# EAGLE design Arduino_Mega14x_V2 (EAGLE 9.6.2)
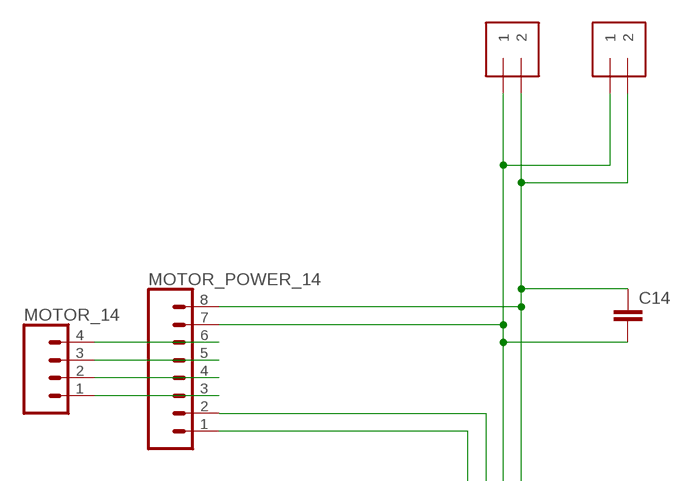
[diagram p0: schematic, sheet 1, part 1 of 3]
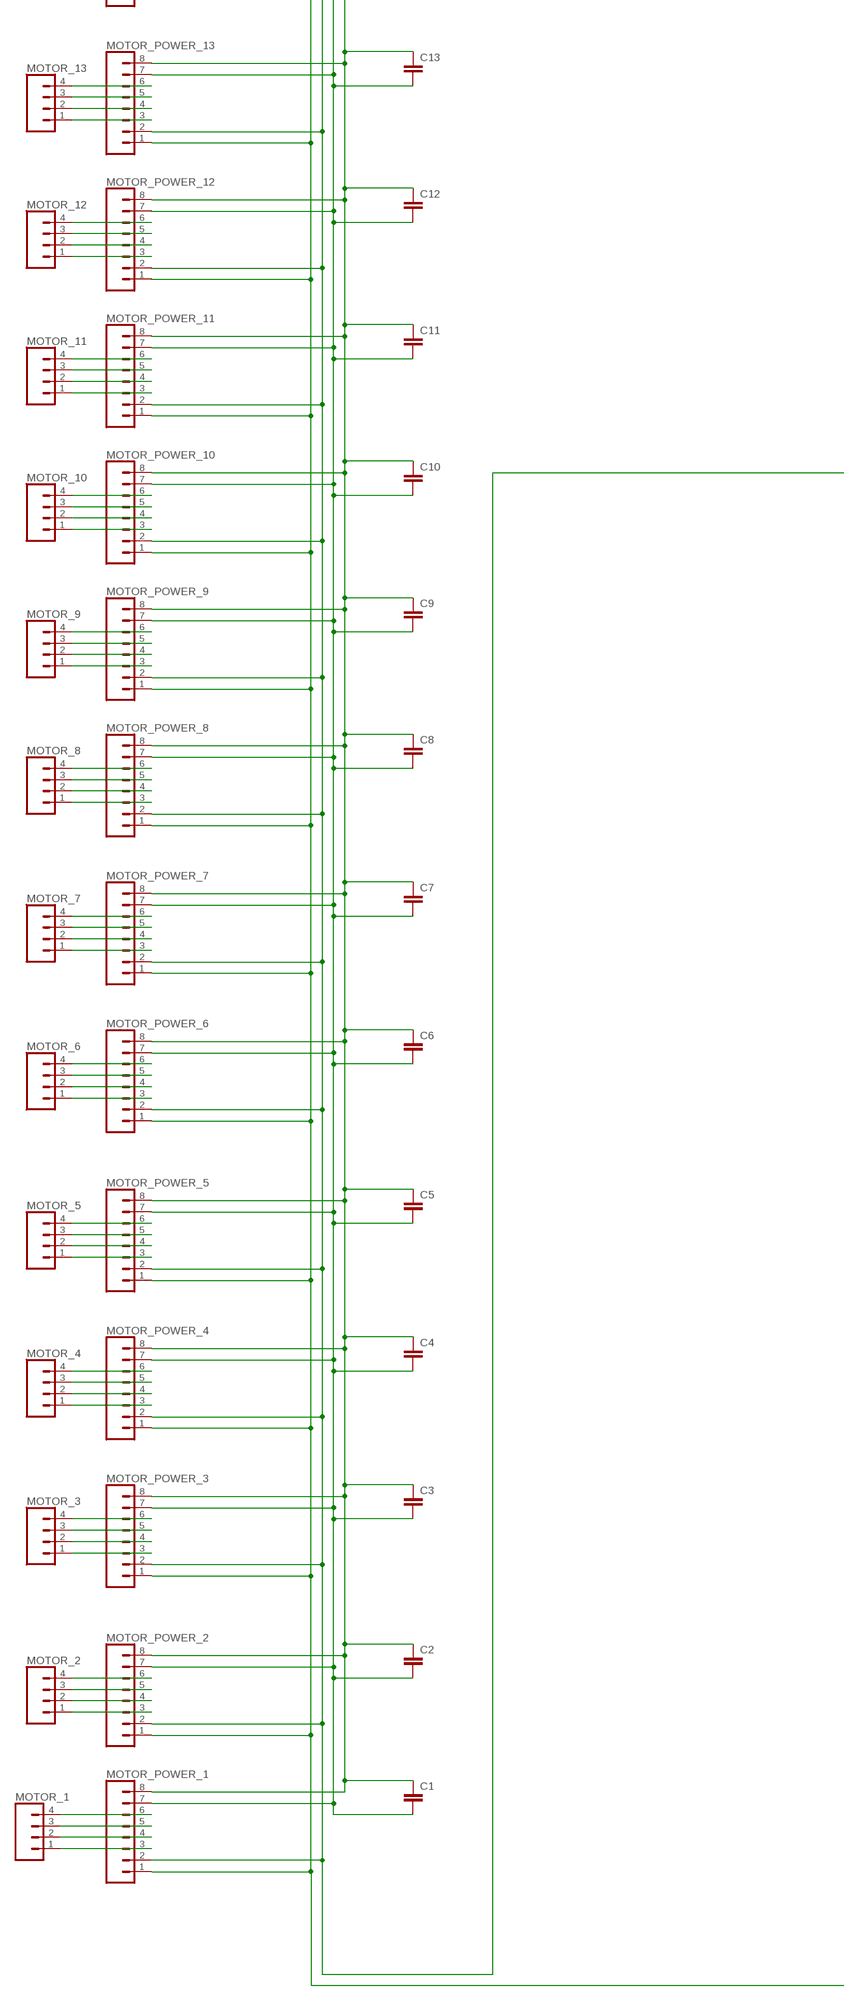
[diagram p1: schematic, sheet 1, part 2 of 3]
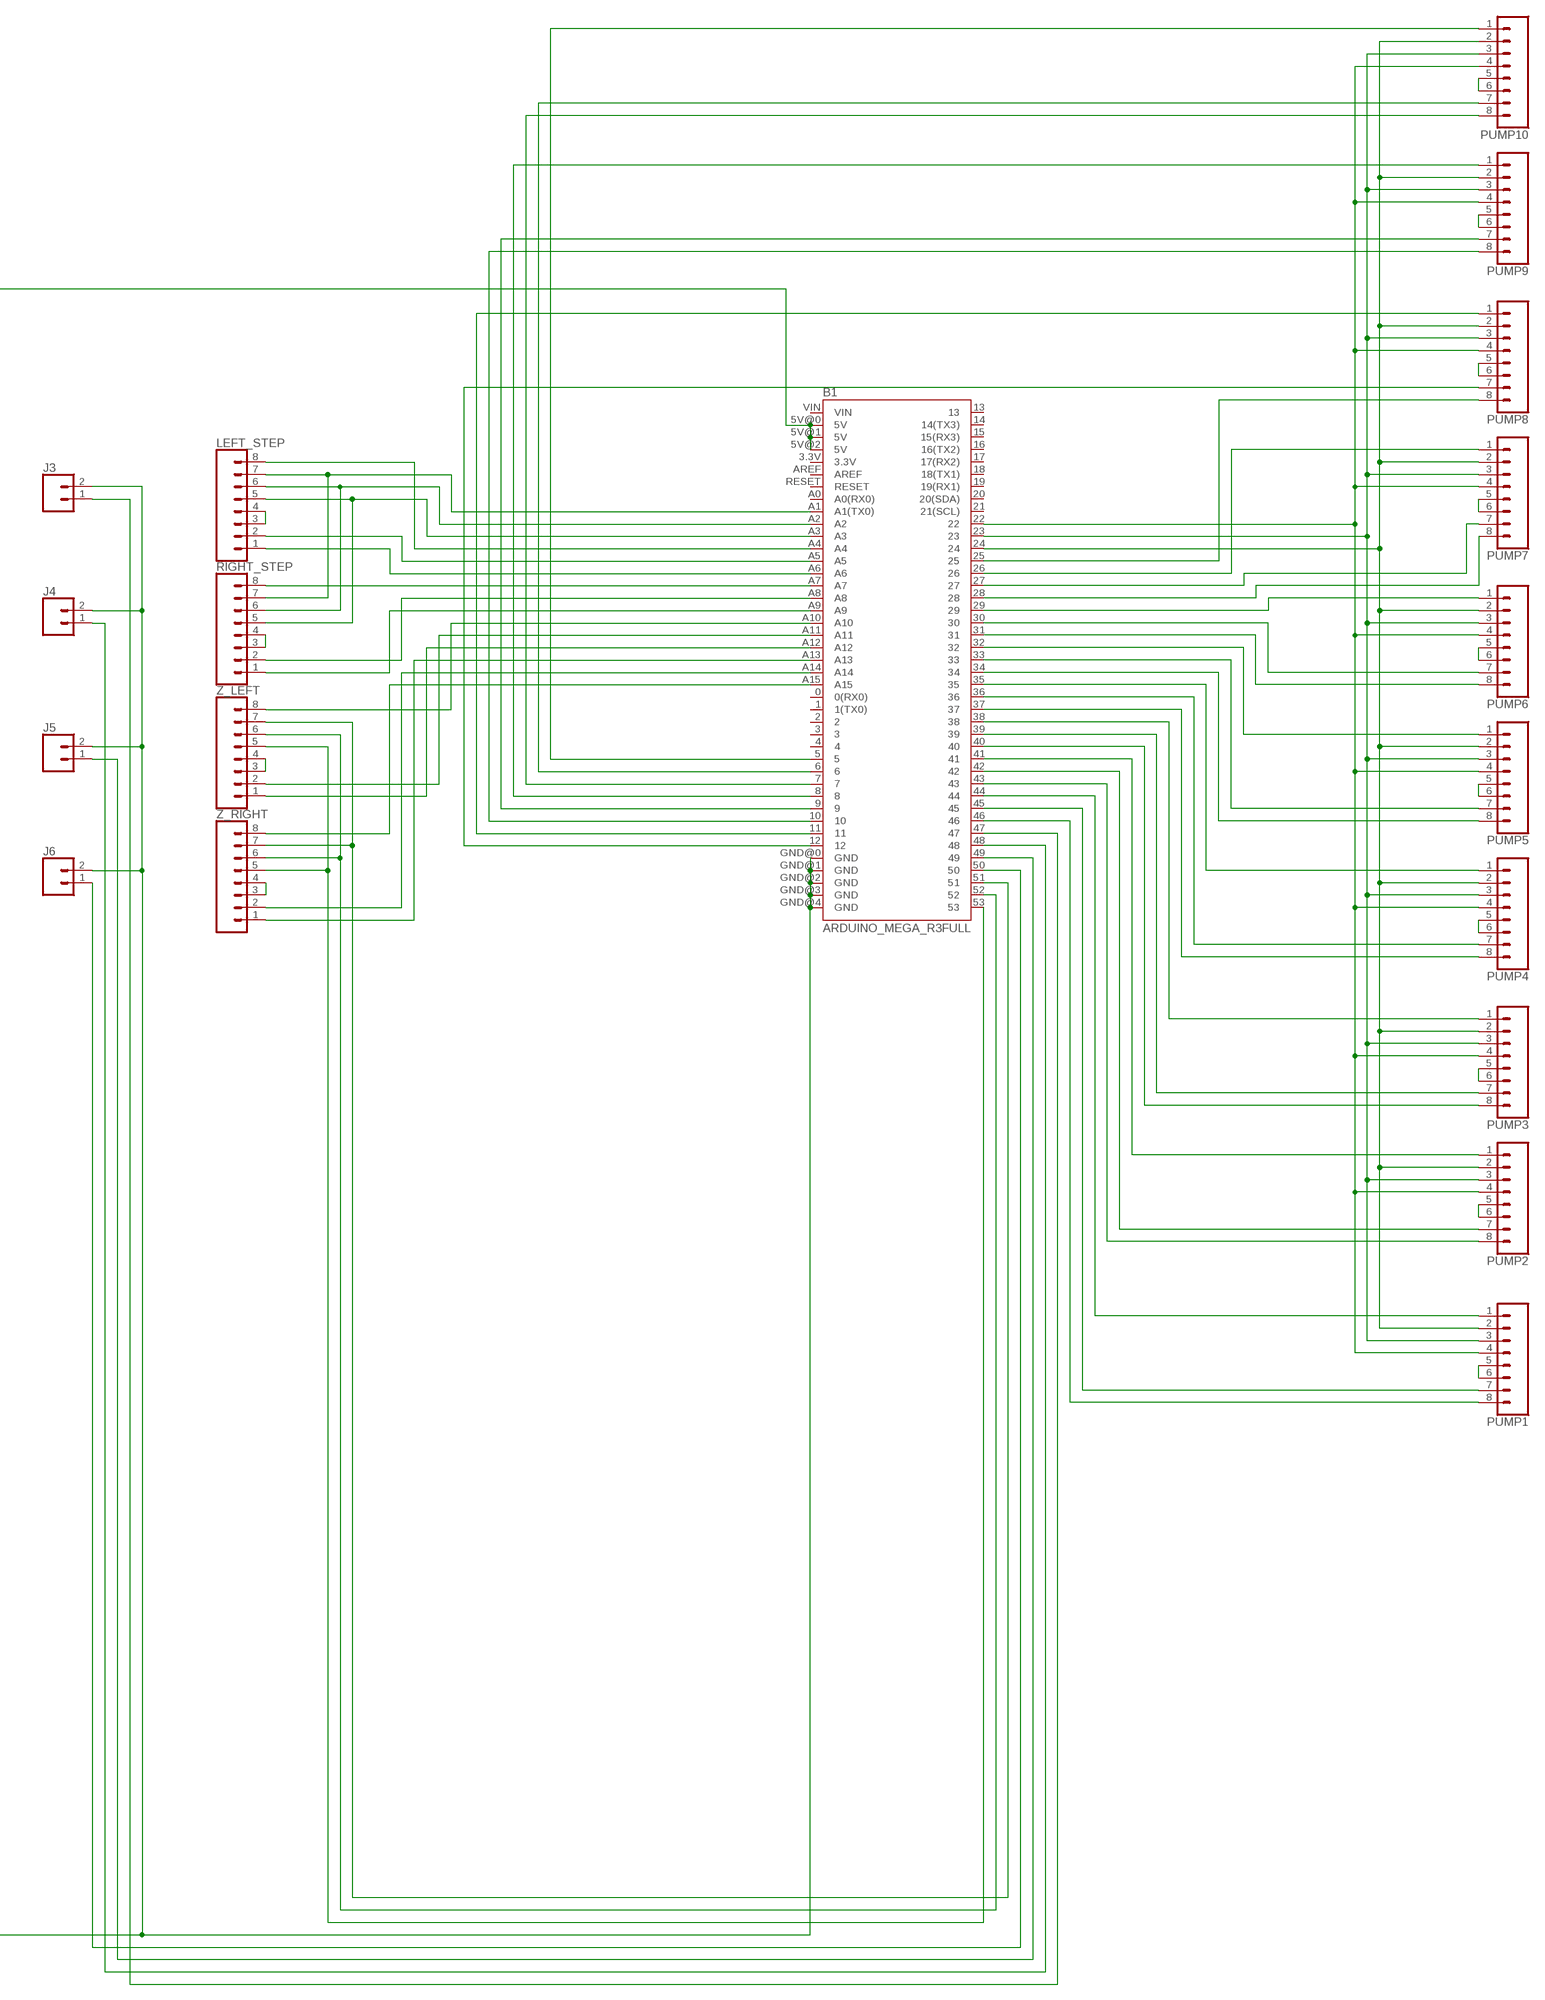
[diagram p2: schematic, sheet 1, part 3 of 3]

## Parts
B1  ARDUINO_MEGA_R3FULL  [ARDUINO_MEGA]
C1  C5/2.5  [C5B2.5]
C2  C5/2.5  [C5B2.5]
C3  C5/2.5  [C5B2.5]
C4  C5/2.5  [C5B2.5]
C5  C5/2.5  [C5B2.5]
C6  C5/2.5  [C5B2.5]
C7  C5/2.5  [C5B2.5]
C8  C5/2.5  [C5B2.5]
C9  C5/2.5  [C5B2.5]
C10  C5/2.5  [C5B2.5]
C11  C5/2.5  [C5B2.5]
C12  C5/2.5  [C5B2.5]
C13  C5/2.5  [C5B2.5]
C14  C5/2.5  [C5B2.5]
J1  1X2-3.5MM  [1X2-3.5MM]
J2  1X2-3.5MM  [1X2-3.5MM]
J3  CONN_02  [1X02]
J4  CONN_02  [1X02]
J5  CONN_02  [1X02]
J6  CONN_02  [1X02]
LEFT_STEP  CONN_08"  [1X08]
MOTOR_1  CONN_04  [1X04]
MOTOR_2  CONN_04  [1X04]
MOTOR_3  CONN_04  [1X04]
MOTOR_4  CONN_04  [1X04]
MOTOR_5  CONN_04  [1X04]
MOTOR_6  CONN_04  [1X04]
MOTOR_7  CONN_04  [1X04]
MOTOR_8  CONN_04  [1X04]
MOTOR_9  CONN_04  [1X04]
MOTOR_10  CONN_04  [1X04]
MOTOR_11  CONN_04  [1X04]
MOTOR_12  CONN_04  [1X04]
MOTOR_13  CONN_04  [1X04]
MOTOR_14  CONN_04  [1X04]
MOTOR_POWER_1  CONN_08"  [1X08]
MOTOR_POWER_2  CONN_08"  [1X08]
MOTOR_POWER_3  CONN_08"  [1X08]
MOTOR_POWER_4  CONN_08"  [1X08]
MOTOR_POWER_5  CONN_08"  [1X08]
MOTOR_POWER_6  CONN_08"  [1X08]
MOTOR_POWER_7  CONN_08"  [1X08]
MOTOR_POWER_8  CONN_08"  [1X08]
MOTOR_POWER_9  CONN_08"  [1X08]
MOTOR_POWER_10  CONN_08"  [1X08]
MOTOR_POWER_11  CONN_08"  [1X08]
MOTOR_POWER_12  CONN_08"  [1X08]
MOTOR_POWER_13  CONN_08"  [1X08]
MOTOR_POWER_14  CONN_08"  [1X08]
PUMP1  CONN_08"  [1X08]
PUMP2  CONN_08"  [1X08]
PUMP3  CONN_08"  [1X08]
PUMP4  CONN_08"  [1X08]
PUMP5  CONN_08"  [1X08]
PUMP6  CONN_08"  [1X08]
PUMP7  CONN_08"  [1X08]
PUMP8  CONN_08"  [1X08]
PUMP9  CONN_08"  [1X08]
PUMP10  CONN_08"  [1X08]
RIGHT_STEP  CONN_08"  [1X08]
Z_LEFT  CONN_08"  [1X08]
Z_RIGHT  CONN_08"  [1X08]

## Nets
N$1: MOTOR_1.1 MOTOR_POWER_1.3
N$2: MOTOR_1.2 MOTOR_POWER_1.4
N$3: MOTOR_1.3 MOTOR_POWER_1.5
N$4: LEFT_STEP.3 LEFT_STEP.4
N$5: MOTOR_1.4 MOTOR_POWER_1.6
N$6: MOTOR_2.1 MOTOR_POWER_2.3
N$7: MOTOR_2.2 MOTOR_POWER_2.4
N$8: RIGHT_STEP.3 RIGHT_STEP.4
N$9: MOTOR_2.3 MOTOR_POWER_2.5
N$10: MOTOR_2.4 MOTOR_POWER_2.6
N$11: MOTOR_3.1 MOTOR_POWER_3.3
N$12: MOTOR_3.2 MOTOR_POWER_3.4
N$13: MOTOR_3.3 MOTOR_POWER_3.5
N$14: MOTOR_3.4 MOTOR_POWER_3.6
N$15: MOTOR_4.1 MOTOR_POWER_4.3
N$16: MOTOR_4.2 MOTOR_POWER_4.4
N$17: MOTOR_4.3 MOTOR_POWER_4.5
N$18: Z_LEFT.3 Z_LEFT.4
N$19: MOTOR_4.4 MOTOR_POWER_4.6
N$20: MOTOR_5.1 MOTOR_POWER_5.3
N$21: MOTOR_5.2 MOTOR_POWER_5.4
N$22: MOTOR_5.3 MOTOR_POWER_5.5
N$23: MOTOR_5.4 MOTOR_POWER_5.6
N$24: MOTOR_6.1 MOTOR_POWER_6.3
N$25: Z_RIGHT.3 Z_RIGHT.4
N$26: MOTOR_6.2 MOTOR_POWER_6.4
N$27: PUMP1.5 PUMP1.6
N$28: MOTOR_6.3 MOTOR_POWER_6.5
N$29: MOTOR_6.4 MOTOR_POWER_6.6
N$30: MOTOR_7.1 MOTOR_POWER_7.3
N$31: MOTOR_7.2 MOTOR_POWER_7.4
N$32: PUMP2.5 PUMP2.6
N$33: MOTOR_7.3 MOTOR_POWER_7.5
N$34: MOTOR_7.4 MOTOR_POWER_7.6
N$35: PUMP3.5 PUMP3.6
N$36: MOTOR_8.1 MOTOR_POWER_8.3
N$37: MOTOR_8.2 MOTOR_POWER_8.4
N$38: MOTOR_8.3 MOTOR_POWER_8.5
N$39: MOTOR_8.4 MOTOR_POWER_8.6
N$40: PUMP4.5 PUMP4.6
N$41: MOTOR_9.1 MOTOR_POWER_9.3
N$42: MOTOR_9.2 MOTOR_POWER_9.4
N$43: MOTOR_9.3 MOTOR_POWER_9.5
N$44: PUMP5.5 PUMP5.6
N$45: MOTOR_9.4 MOTOR_POWER_9.6
N$46: MOTOR_10.1 MOTOR_POWER_10.3
N$47: MOTOR_10.2 MOTOR_POWER_10.4
N$48: PUMP6.5 PUMP6.6
N$49: MOTOR_10.3 MOTOR_POWER_10.5
N$50: MOTOR_10.4 MOTOR_POWER_10.6
N$51: MOTOR_11.1 MOTOR_POWER_11.3
N$52: PUMP7.5 PUMP7.6
N$53: MOTOR_11.2 MOTOR_POWER_11.4
N$54: MOTOR_11.3 MOTOR_POWER_11.5
N$55: MOTOR_11.4 MOTOR_POWER_11.6
N$56: PUMP8.5 PUMP8.6
N$57: MOTOR_12.1 MOTOR_POWER_12.3
N$58: MOTOR_12.2 MOTOR_POWER_12.4
N$59: MOTOR_12.3 MOTOR_POWER_12.5
N$60: PUMP9.5 PUMP9.6
N$61: MOTOR_12.4 MOTOR_POWER_12.6
N$62: MOTOR_13.1 MOTOR_POWER_13.3
N$63: MOTOR_13.2 MOTOR_POWER_13.4
N$64: PUMP10.5 PUMP10.6
N$65: MOTOR_13.3 MOTOR_POWER_13.5
N$66: MOTOR_13.4 MOTOR_POWER_13.6
N$67: MOTOR_14.1 MOTOR_POWER_14.3
N$68: MOTOR_14.2 MOTOR_POWER_14.4
N$69: MOTOR_14.3 MOTOR_POWER_14.5
N$70: MOTOR_14.4 MOTOR_POWER_14.6
N$71: B1.GND@0(GND) B1.GND@1(GND) B1.GND@2(GND) B1.GND@3(GND) B1.GND@4(GND) J3.2 J4.2 J5.2 J6.2 MOTOR_POWER_1.1 MOTOR_POWER_2.1 MOTOR_POWER_3.1 MOTOR_POWER_4.1 MOTOR_POWER_5.1 MOTOR_POWER_6.1 MOTOR_POWER_7.1 MOTOR_POWER_8.1 MOTOR_POWER_9.1 MOTOR_POWER_10.1 MOTOR_POWER_11.1 MOTOR_POWER_12.1 MOTOR_POWER_13.1 MOTOR_POWER_14.1
N$72: B1.A1(A1(TX0)) LEFT_STEP.7 RIGHT_STEP.7
N$73: B1.A2 LEFT_STEP.6 RIGHT_STEP.6
N$74: B1.A3 LEFT_STEP.5 RIGHT_STEP.5
N$75: B1.51 Z_LEFT.7 Z_RIGHT.7
N$76: B1.52 Z_LEFT.6 Z_RIGHT.6
N$77: B1.53 Z_LEFT.5 Z_RIGHT.5
N$78: B1.22 PUMP1.4 PUMP2.4 PUMP3.4 PUMP4.4 PUMP5.4 PUMP6.4 PUMP7.4 PUMP8.4 PUMP9.4 PUMP10.4
N$79: B1.23 PUMP1.3 PUMP2.3 PUMP3.3 PUMP4.3 PUMP5.3 PUMP6.3 PUMP7.3 PUMP8.3 PUMP9.3 PUMP10.3
N$80: B1.24 PUMP1.2 PUMP2.2 PUMP3.2 PUMP4.2 PUMP5.2 PUMP6.2 PUMP7.2 PUMP8.2 PUMP9.2 PUMP10.2
N$81: B1.A15 Z_RIGHT.8
N$82: B1.5V@0(5V) B1.5V@1(5V) B1.5V@2(5V) MOTOR_POWER_1.2 MOTOR_POWER_2.2 MOTOR_POWER_3.2 MOTOR_POWER_4.2 MOTOR_POWER_5.2 MOTOR_POWER_6.2 MOTOR_POWER_7.2 MOTOR_POWER_8.2 MOTOR_POWER_9.2 MOTOR_POWER_10.2 MOTOR_POWER_11.2 MOTOR_POWER_12.2 MOTOR_POWER_13.2 MOTOR_POWER_14.2
N$83 [Thick]: C1.2 C2.2 C3.2 C4.2 C5.2 C6.2 C7.2 C8.2 C9.2 C10.2 C11.2 C12.2 C13.2 C14.2 J1.1 J2.1 MOTOR_POWER_1.7 MOTOR_POWER_2.7 MOTOR_POWER_3.7 MOTOR_POWER_4.7 MOTOR_POWER_5.7 MOTOR_POWER_6.7 MOTOR_POWER_7.7 MOTOR_POWER_8.7 MOTOR_POWER_9.7 MOTOR_POWER_10.7 MOTOR_POWER_11.7 MOTOR_POWER_12.7 MOTOR_POWER_13.7 MOTOR_POWER_14.7
N$84 [Thick]: C1.1 C2.1 C3.1 C4.1 C5.1 C6.1 C7.1 C8.1 C9.1 C10.1 C11.1 C12.1 C13.1 C14.1 J1.2 J2.2 MOTOR_POWER_1.8 MOTOR_POWER_2.8 MOTOR_POWER_3.8 MOTOR_POWER_4.8 MOTOR_POWER_5.8 MOTOR_POWER_6.8 MOTOR_POWER_7.8 MOTOR_POWER_8.8 MOTOR_POWER_9.8 MOTOR_POWER_10.8 MOTOR_POWER_11.8 MOTOR_POWER_12.8 MOTOR_POWER_13.8 MOTOR_POWER_14.8
N$85: B1.A14 Z_RIGHT.2
N$86: B1.A13 Z_RIGHT.1
N$87: B1.A12 Z_LEFT.1
N$88: B1.A11 Z_LEFT.2
N$89: B1.A10 Z_LEFT.8
N$90: B1.A9 RIGHT_STEP.1
N$91: B1.A8 RIGHT_STEP.2
N$92: B1.A7 RIGHT_STEP.8
N$93: B1.A6 LEFT_STEP.1
N$94: B1.A5 LEFT_STEP.2
N$95: B1.A4 LEFT_STEP.8
N$96: B1.50 J6.1
N$97: B1.49 J5.1
N$98: B1.48 J4.1
N$99: B1.47 J3.1
N$100: B1.46 PUMP1.8
N$101: B1.45 PUMP1.7
N$102: B1.44 PUMP1.1
N$103: B1.43 PUMP2.8
N$104: B1.42 PUMP2.7
N$105: B1.41 PUMP2.1
N$106: B1.40 PUMP3.8
N$107: B1.39 PUMP3.7
N$108: B1.38 PUMP3.1
N$109: B1.37 PUMP4.8
N$110: B1.36 PUMP4.7
N$111: B1.35 PUMP4.1
N$112: B1.34 PUMP5.8
N$113: B1.33 PUMP5.7
N$114: B1.32 PUMP5.1
N$115: B1.31 PUMP6.8
N$116: B1.30 PUMP6.7
N$117: B1.29 PUMP6.1
N$118: B1.28 PUMP7.8
N$119: B1.27 PUMP7.7
N$120: B1.26 PUMP7.1
N$121: B1.25 PUMP8.8
N$122: B1.12 PUMP8.7
N$123: B1.11 PUMP8.1
N$124: B1.10 PUMP9.8
N$125: B1.9 PUMP9.7
N$126: B1.8 PUMP9.1
N$127: B1.7 PUMP10.8
N$128: B1.6 PUMP10.7
N$129: B1.5 PUMP10.1
Unconnected: B1.0(0(RX0)) B1.1(1(TX0)) B1.2 B1.3 B1.3.3V B1.4 B1.13 B1.14(14(TX3)) B1.15(15(RX3)) B1.16(16(TX2)) B1.17(17(RX2)) B1.18(18(TX1)) B1.19(19(RX1)) B1.20(20(SDA)) B1.21(21(SCL)) B1.A0(A0(RX0)) B1.AREF B1.RESET B1.VIN

## Library data of the parts
B1 = SparkFun-Mega_Shield:ARDUINO_MEGA_R3: Arduino Mega R3 ATmega2560 R3 compatible footprint. SparkFun Products: Arduino Mega 2560 R3 <https://www.sparkfun.com/products/11061>
C1-C14 = capacitor-wima:C: CAPACITOR naming: grid - package width
J1 J2 = adafruit:1X2: 3.5mm Terminal block http://www.ladyada.net/library/pcb/eaglelibrary.html
J3-J6 = SparkFun-Connectors:CONN_02: Multi connection point. Often used as Generic Header-pin footprint for 0.1 inch spaced/style header connections On any of the 0.1 inch spaced packages, you can populate with these: Break Away Headers - Straight <https://www.sparkfun.com/products/116> (PRT-00116) Break Away Male Headers - Right Angle <https://www.sparkfun.com/products/553> (PRT-00553) Female Headers <https://www.sparkfun.com/products/115> (PRT-00115) Break Away Headers - Machine Pin <https://www.sparkfun.com/products/117> (PRT-00117) Break Away Female Headers - Swiss Machine Pin <https://www.sparkfun.com/products/743> (PRT-00743) For SCREWTERMINALS and SPRING TERMINALS visit here: Screw Terimnals on SparkFun.com <https://www.sparkfun.com/search/results?term=Screw+Terminals> (5mm/3.5mm/2.54mm spacing) This device is also useful as a general connection point to wire up your design to another part of your project. Our various solder wires solder well into these plated through hole pads. Hook-Up Wire - Assortment (Stranded, 22 AWG) <https://www.sparkfun.com/products/11375> (PRT-11375) Hook-Up Wire - Assortment (Solid Core, 22 AWG) <https://www.sparkfun.com/products/11367> (PRT-11367) View the entire wire category on our website here <https://www.sparkfun.com/categories/141> Special notes: Molex polarized connector foot print use with: PRT-08233 with associated crimp pins and housings. 2.54_SCREWTERM for use with PRT-10571. 3.5mm Screw Terminal footprints for PRT-08084 5mm Screw Terminal footprints for use with PRT-08432
LEFT_STEP MOTOR_POWER_1-MOTOR_POWER_14 PUMP1-PUMP10 RIGHT_STEP Z_LEFT Z_RIGHT = SparkFun-Connectors:CONN_08: Multi connection point. Often used as Generic Header-pin footprint for 0.1 inch spaced/style header connections On any of the 0.1 inch spaced packages, you can populate with these: Break Away Headers - Straight <https://www.sparkfun.com/products/116> (PRT-00116) Break Away Male Headers - Right Angle <https://www.sparkfun.com/products/553> (PRT-00553) Female Headers <https://www.sparkfun.com/products/115> (PRT-00115) Break Away Headers - Machine Pin <https://www.sparkfun.com/products/117> (PRT-00117) Break Away Female Headers - Swiss Machine Pin <https://www.sparkfun.com/products/743> (PRT-00743) Arduino Stackable Header - 8 Pin <https://www.sparkfun.com/products/9279> (PRT-09279) For SCREWTERMINALS and SPRING TERMINALS visit here: Screw Terimnals on SparkFun.com <https://www.sparkfun.com/search/results?term=Screw+Terminals> (5mm/3.5mm/2.54mm spacing) This device is also useful as a general connection point to wire up your design to another part of your project. Our various solder wires solder well into these plated through hole pads. Hook-Up Wire - Assortment (Stranded, 22 AWG) <https://www.sparkfun.com/products/11375> (PRT-11375) Hook-Up Wire - Assortment (Solid Core, 22 AWG) <https://www.sparkfun.com/products/11367> (PRT-11367) View the entire wire category on our website here <https://www.sparkfun.com/categories/141> Special notes: Molex polarized connector foot print use with SKU : PRT-08231 with associated crimp pins and housings. 1MM SMD Version SKU: PRT-10208 NOTES ON THE VARIANTS LOCK and LOCK_LONGPADS... This footprint was designed to help hold the alignment of a through-hole component (i.e. 6-pin header) while soldering it into place. You may notice that each hole has been shifted either up or down by 0.005 of an inch from it's more standard position (which is a perfectly straight line). This slight alteration caused the pins (the squares in the middle) to touch the edges of the holes. Because they are alternating, it causes a "brace" to hold the component in place. 0.005 has proven to be the perfect amount of "off-center" position when using our standard breakaway headers. Although looks a little odd when you look at the bare footprint, once you have a header in there, the alteration is very hard to notice. Also,if you push a header all the way into place, it is covered up entirely on the bottom side.; PROD_ID: CONN-08438
MOTOR_1-MOTOR_14 = SparkFun-Connectors:CONN_04: Multi connection point. Often used as Generic Header-pin footprint for 0.1 inch spaced/style header connections On any of the 0.1 inch spaced packages, you can populate with these: Break Away Headers - Straight <https://www.sparkfun.com/products/116> (PRT-00116) Break Away Male Headers - Right Angle <https://www.sparkfun.com/products/553> (PRT-00553) Female Headers <https://www.sparkfun.com/products/115> (PRT-00115) Break Away Headers - Machine Pin <https://www.sparkfun.com/products/117> (PRT-00117) Break Away Female Headers - Swiss Machine Pin <https://www.sparkfun.com/products/743> (PRT-00743) For SCREWTERMINALS and SPRING TERMINALS visit here: Screw Terimnals on SparkFun.com <https://www.sparkfun.com/search/results?term=Screw+Terminals> (5mm/3.5mm/2.54mm spacing) This device is also useful as a general connection point to wire up your design to another part of your project. Our various solder wires solder well into these plated through hole pads. Hook-Up Wire - Assortment (Stranded, 22 AWG) <https://www.sparkfun.com/products/11375> (PRT-11375) Hook-Up Wire - Assortment (Solid Core, 22 AWG) <https://www.sparkfun.com/products/11367> (PRT-11367) View the entire wire category on our website here <https://www.sparkfun.com/categories/141> Special notes: Molex polarized connector foot print use with SKU : PRT-08231 with associated crimp pins and housings. 1MM SMD Version SKU: PRT-10208; PROD_ID: CONN-09696

## Net classes
1 Thick: width 0.5 mm, clearance 0.5 mm

## Board
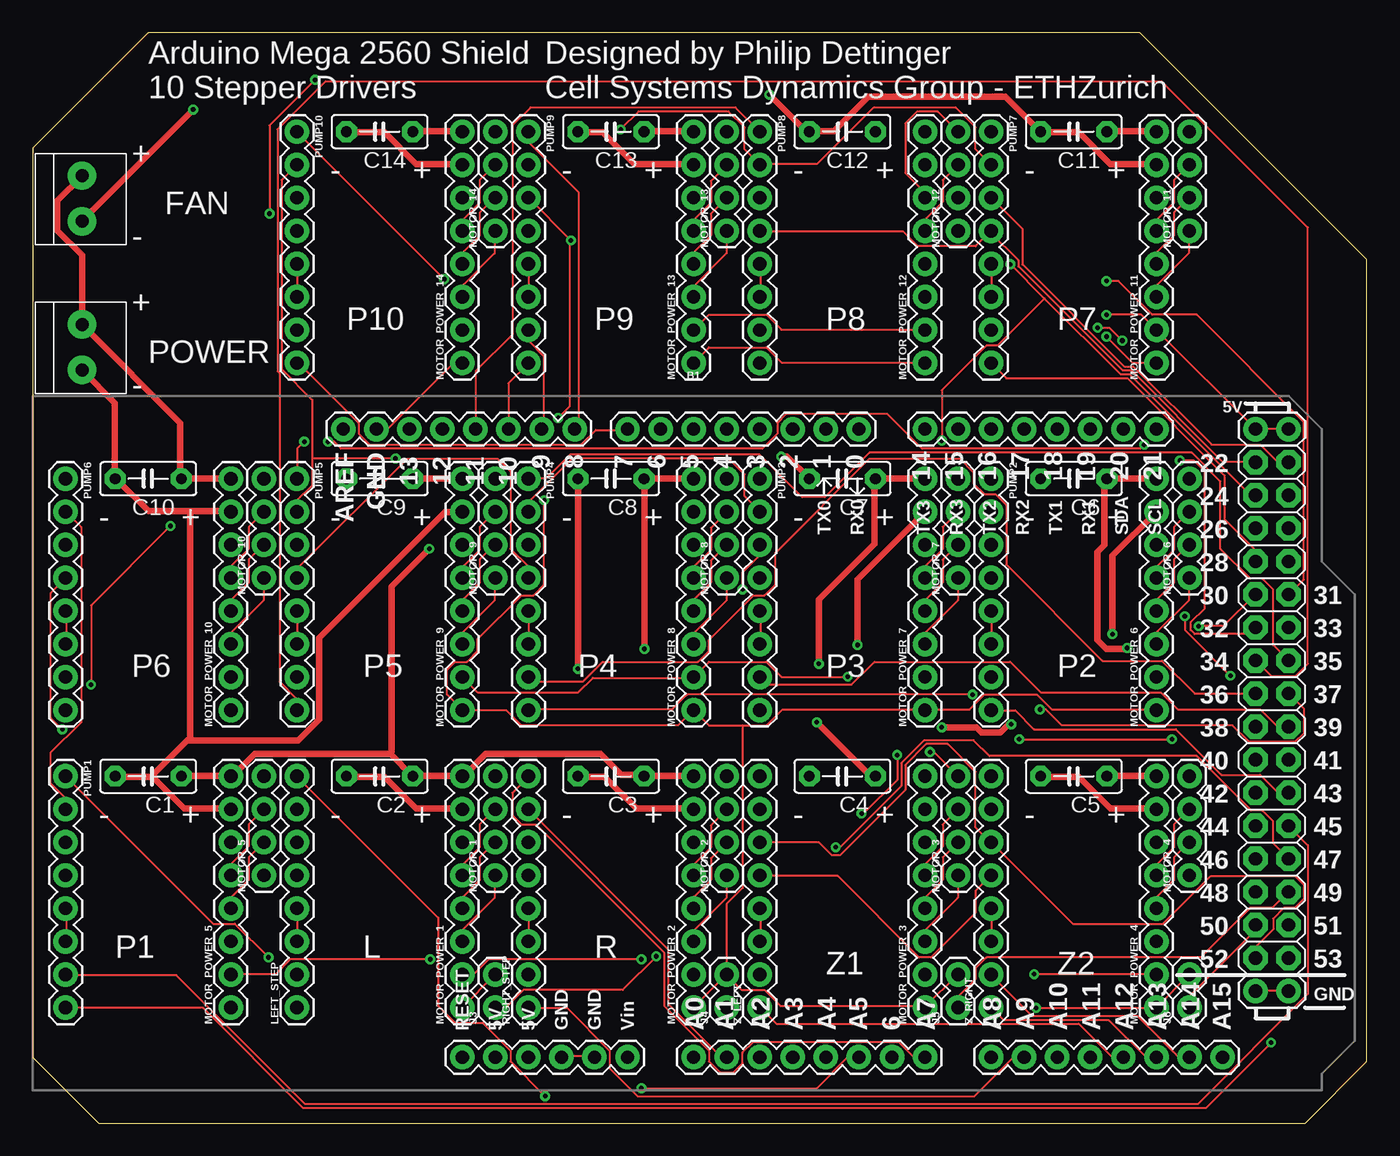
[diagram p3: board, top side]
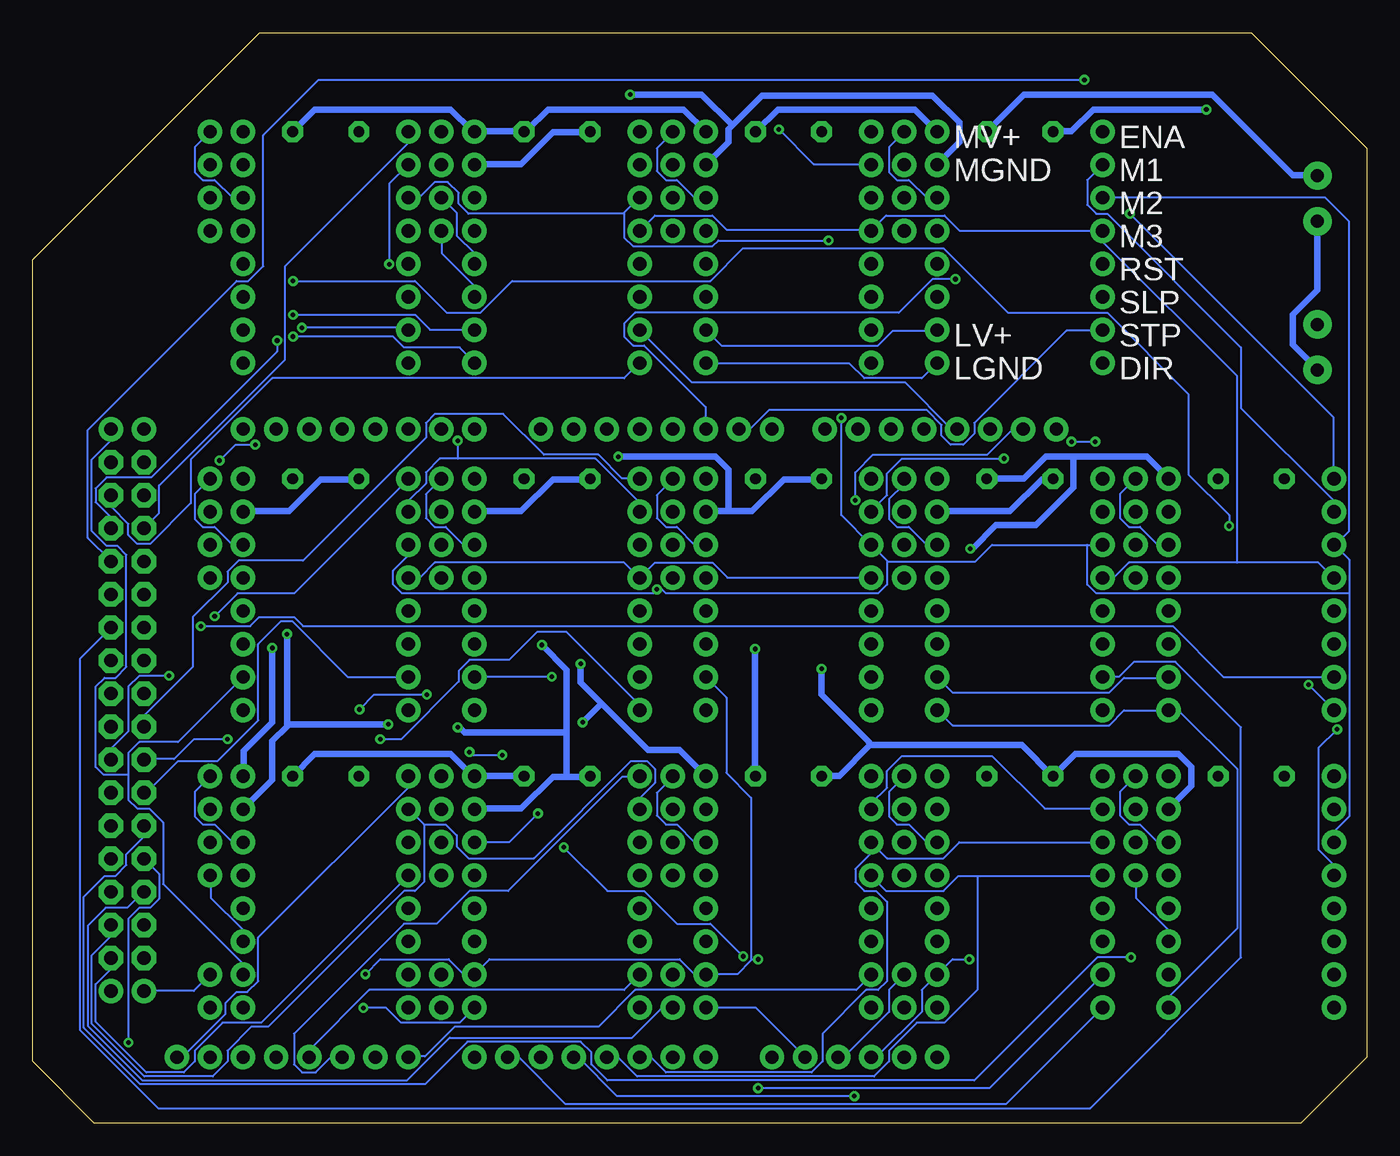
[diagram p4: board, bottom side, seen from below]

Size 102.54 x 83.82 mm. Coordinates in mm from the lower left corner, seen from the top.
Outline: 0,74.93 0,5.08 5.08,0 97.79,0 102.54,4.75 102.54,66.37 85.09,83.82 8.89,83.82 0,74.93
Copper layers (1*16): Top 0.035mm / dielectric 1.5mm / Bottom 0.035mm
Design rules "default": minimum track width 6mil, minimum drill 0.35mm, track to track 6mil, track to pad 6mil, pad to pad 6mil, via to via 6mil, smd to smd 6mil, copper to edge 40mil, drill to drill 6mil, minimum pad ring 10mil, minimum via ring 8mil, stop-mask expansion 4mil, vias tented up to drill 0mil, thermal gap 10mil

### Footprints (pad centres in the part's own frame; a part is rotated, then mirrored left to right if it is on the bottom)
ARDUINO_MEGA = drill 1.016 pad 1.88: 0 13.97,24.13; 1 11.43,24.13; 2 8.89,24.13; 3 6.35,24.13; 3.3V -13.97,-24.13; 4 3.81,24.13; 5 1.27,24.13; 5V@0 -11.43,-24.13; 5V@1 44.45,24.13; 5V@2 46.99,24.13; 6 -1.27,24.13; 7 -3.81,24.13; 8 -7.874,24.13; 9 -10.414,24.13; 10 -12.954,24.13; 11 -15.494,24.13; 12 -18.034,24.13; 13 -20.574,24.13; 14 19.05,24.13; 15 21.59,24.13; 16 24.13,24.13; 17 26.67,24.13; 18 29.21,24.13; 19 31.75,24.13; 20 34.29,24.13; 21 36.83,24.13; A0 1.27,-24.13; A1 3.81,-24.13; A2 6.35,-24.13; A3 8.89,-24.13; A4 11.43,-24.13; A5 13.97,-24.13; A6 16.51,-24.13; A7 19.05,-24.13; A8 24.13,-24.13; A9 26.67,-24.13; A10 29.21,-24.13; A11 31.75,-24.13; A12 34.29,-24.13; A13 36.83,-24.13; A14 39.37,-24.13; A15 41.91,-24.13; AREF -25.654,24.13; GND@0 -8.89,-24.13; GND@1 -6.35,-24.13; GND@2 44.45,-19.05; GND@3 46.99,-19.05; GND@4 -23.114,24.13; RESET -16.51,-24.13; VIN -3.81,-24.13 | drill 1.016 pad 1.88 octagon: 22 44.45,21.59; 23 46.99,21.59; 24 44.45,19.05; 25 46.99,19.05; 26 44.45,16.51; 27 46.99,16.51; 28 44.45,13.97; 29 46.99,13.97; 30 44.45,11.43; 31 46.99,11.43; 32 44.45,8.89; 33 46.99,8.89; 34 44.45,6.35; 35 46.99,6.35; 36 44.45,3.81; 37 46.99,3.81; 38 44.45,1.27; 39 46.99,1.27; 40 44.45,-1.27; 41 46.99,-1.27; 42 44.45,-3.81; 43 46.99,-3.81; 44 44.45,-6.35; 45 46.99,-6.35; 46 44.45,-8.89; 47 46.99,-8.89; 48 44.45,-11.43; 49 46.99,-11.43; 50 44.45,-13.97; 51 46.99,-13.97; 52 44.45,-16.51; 53 46.99,-16.51
C5B2.5 = drill 0.813 pad 1.6 octagon: 1 -2.54,0; 2 2.54,0
1X2-3.5MM = drill 1 pad 2.184: 1 1.8,0; 2 -1.7,0
1X02 = drill 1.016 pad 1.88: 1 0,0; 2 2.54,0
1X08 = drill 1.016 pad 1.88: 1 0,0; 2 2.54,0; 3 5.08,0; 4 7.62,0; 5 10.16,0; 6 12.7,0; 7 15.24,0; 8 17.78,0
1X04 = drill 1.016 pad 1.88: 1 0,0; 2 2.54,0; 3 5.08,0; 4 7.62,0

### Placement (x,y rotation side)
B1  49.53,29.21 0 top
C1  8.89,26.67 180 top
C2  26.67,26.67 180 top
C3  44.45,26.67 180 top
C4  62.23,26.67 180 top
C5  80.01,26.67 180 top
C6  80.01,49.53 180 top
C7  62.23,49.53 180 top
C8  44.45,49.53 180 top
C9  26.67,49.53 180 top
C10  8.89,49.53 180 top
C11  80.01,76.2 180 top
C12  62.23,76.2 180 top
C13  44.45,76.2 180 top
C14  26.67,76.2 180 top
J1  3.81,71.12 270 top
J2  3.81,59.69 270 top
J3  35.56,8.89 90 top
J4  53.34,8.89 90 top
J5  71.12,8.89 90 top
J6  88.9,8.89 90 top
LEFT_STEP  20.32,8.89 90 top
MOTOR_1  35.56,19.05 90 top
MOTOR_2  53.34,19.05 90 top
MOTOR_3  71.12,19.05 90 top
MOTOR_4  88.9,19.05 90 top
MOTOR_5  17.78,19.05 90 top
MOTOR_6  88.9,41.91 90 top
MOTOR_7  71.12,41.91 90 top
MOTOR_8  53.34,41.91 90 top
MOTOR_9  35.56,41.91 90 top
MOTOR_10  17.78,41.91 90 top
MOTOR_11  88.9,68.58 90 top
MOTOR_12  71.12,68.58 90 top
MOTOR_13  53.34,68.58 90 top
MOTOR_14  35.56,68.58 90 top
MOTOR_POWER_1  33.02,8.89 90 top
MOTOR_POWER_2  50.8,8.89 90 top
MOTOR_POWER_3  68.58,8.89 90 top
MOTOR_POWER_4  86.36,8.89 90 top
MOTOR_POWER_5  15.24,8.89 90 top
MOTOR_POWER_6  86.36,31.75 90 top
MOTOR_POWER_7  68.58,31.75 90 top
MOTOR_POWER_8  50.8,31.75 90 top
MOTOR_POWER_9  33.02,31.75 90 top
MOTOR_POWER_10  15.24,31.75 90 top
MOTOR_POWER_11  86.36,58.42 90 top
MOTOR_POWER_12  68.58,58.42 90 top
MOTOR_POWER_13  50.8,58.42 90 top
MOTOR_POWER_14  33.02,58.42 90 top
PUMP1  2.54,26.67 270 top
PUMP2  73.66,49.53 270 top
PUMP3  55.88,49.53 270 top
PUMP4  38.1,49.53 270 top
PUMP5  20.32,49.53 270 top
PUMP6  2.54,49.53 270 top
PUMP7  73.66,76.2 270 top
PUMP8  55.88,76.2 270 top
PUMP9  38.1,76.2 270 top
PUMP10  20.32,76.2 270 top
RIGHT_STEP  38.1,8.89 90 top
Z_LEFT  55.88,8.89 90 top
Z_RIGHT  73.66,8.89 90 top

### Tracks (layer width: path | path; a pad name or v marks a point on that pad's centre or on a via)
N$1
  Top 0.152: MOTOR_POWER_1.3 33.07,13.97 33.07,14.88 35.51,17.32 35.51,19 MOTOR_1.1
N$2
  Top 0.152: MOTOR_POWER_1.4 33.07,16.56 33.07,17.4 34.37,18.69 34.37,20.45 35.51,21.59 MOTOR_1.2
N$3
  Top 0.152: MOTOR_POWER_1.5 33.07,19.07 33.07,19.91 34.37,21.21 34.37,22.96 35.51,24.11 MOTOR_1.3
N$4
  Top 0.152: LEFT_STEP.3 20.34,13.97 20.34,16.48 LEFT_STEP.4
N$5
  Bottom 0.152: MOTOR_POWER_1.6 33.83,21.59 35.2,22.96 36.12,22.96 36.73,23.57 36.73,25.48 35.59,26.62 MOTOR_1.4
N$6
  Top 0.152: MOTOR_2.1 53.34,17.32 50.83,14.81 50.83,13.97 MOTOR_POWER_2.3
N$7
  Top 0.152: MOTOR_2.2 52.12,20.37 52.12,18.69 50.83,17.4 50.83,16.56 MOTOR_POWER_2.4
N$8
  Top 0.152: RIGHT_STEP.4 RIGHT_STEP.3
N$9
  Top 0.152: MOTOR_POWER_2.5 50.83,19.07 50.83,19.91 52.12,21.21 52.12,22.88 53.34,24.11 MOTOR_2.3
N$10
  Bottom 0.152: MOTOR_POWER_2.6 51.66,21.59 53.03,22.96 53.87,22.96 54.56,23.65 54.56,25.4 53.34,26.62 MOTOR_2.4
N$11
  Top 0.152: MOTOR_POWER_3.3 68.58,14.81 71.09,17.32 71.09,19 MOTOR_3.1
N$12
  Top 0.152: MOTOR_POWER_3.4 68.58,17.32 69.95,18.69 69.95,20.45 71.09,21.59 MOTOR_3.2
N$13
  Top 0.152: MOTOR_POWER_3.5 68.58,19.91 69.95,21.29 69.95,22.96 MOTOR_3.3
N$14  (via drill 0.35)
  Top 0.152: v63.7,23.8 63.86,23.8 66.45,26.39 v66.45,28.3 | v68.96,28.52 69.27,28.52 MOTOR_3.4
  Bottom 0.152: MOTOR_POWER_3.6 65.91,21.59 v63.7,23.8 | v66.45,28.3 68.73,28.3 v68.96,28.52
N$15
  Bottom 0.152: MOTOR_POWER_4.3 86.41,13.97 86.41,14.88 88.85,17.32 88.85,19 MOTOR_4.1
N$16
  Top 0.152: MOTOR_POWER_4.4 86.41,16.56 86.41,17.4 87.71,18.69 87.71,20.45 88.85,21.59 MOTOR_4.2
N$17
  Top 0.152: MOTOR_POWER_4.5 86.41,19.07 86.41,19.91 87.71,21.21 87.71,22.96 88.85,24.11 MOTOR_4.3
N$18
  Top 0.152: Z_LEFT.3 55.93,13.97 55.93,16.48 Z_LEFT.4
N$19
  Bottom 0.152: MOTOR_POWER_4.6 87.17,21.59 88.54,22.96 89.46,22.96 90.07,23.57 90.07,25.48 88.92,26.62 MOTOR_4.4
N$20
  Bottom 0.152: MOTOR_POWER_5.3 15.24,14.81 17.75,17.32 17.75,19 MOTOR_5.1
N$21
  Top 0.152: MOTOR_POWER_5.4 15.24,17.32 16.61,18.69 16.61,20.45 17.75,21.59 MOTOR_5.2
N$22
  Top 0.152: MOTOR_POWER_5.5 15.24,19.91 16.61,21.29 16.61,22.96 MOTOR_5.3
N$23
  Bottom 0.152: MOTOR_POWER_5.6 16.08,21.59 17.45,22.96 18.29,22.96 18.97,23.65 18.97,25.48 MOTOR_5.4
N$24
  Top 0.152: MOTOR_POWER_6.3 86.41,36.83 86.41,37.74 88.85,40.18 88.85,41.86 MOTOR_6.1
N$25
  Top 0.152: Z_RIGHT.3 73.69,13.97 73.69,16.48 Z_RIGHT.4
N$26
  Top 0.152: MOTOR_POWER_6.4 86.41,39.42 86.41,40.26 87.71,41.55 87.71,43.31 88.85,44.45 MOTOR_6.2
N$27
  Top 0.152: PUMP1.6 2.59,13.97 2.59,16.48 PUMP1.5
N$28
  Top 0.152: MOTOR_POWER_6.5 86.41,41.94 86.41,42.77 87.71,44.07 87.71,45.82 88.85,46.96 MOTOR_6.3
N$29
  Bottom 0.152: MOTOR_POWER_6.6 87.17,44.45 88.54,45.82 89.46,45.82 90.07,46.43 90.07,48.34 88.92,49.48 MOTOR_6.4
N$30
  Top 0.152: MOTOR_POWER_7.3 68.58,37.67 71.09,40.18 71.09,41.86 MOTOR_7.1
N$31
  Top 0.152: MOTOR_POWER_7.4 68.58,40.18 69.95,41.55 69.95,43.31 71.09,44.45 MOTOR_7.2
N$32
  Top 0.152: PUMP2.6 73.69,36.83 73.69,39.34 PUMP2.5
N$33
  Top 0.152: MOTOR_POWER_7.5 68.58,42.77 69.95,44.14 69.95,45.82 MOTOR_7.3
N$34
  Bottom 0.152: MOTOR_POWER_7.6 69.42,44.45 70.79,45.82 71.63,45.82 72.31,46.51 72.31,48.34 MOTOR_7.4
N$35
  Top 0.152: PUMP3.6 55.93,36.83 55.93,39.34 PUMP3.5
N$36
  Top 0.152: MOTOR_8.1 53.34,40.18 50.83,37.67 50.83,36.83 MOTOR_POWER_8.3
N$37
  Top 0.152: MOTOR_8.2 52.12,43.23 52.12,41.55 50.83,40.26 50.83,39.42 MOTOR_POWER_8.4
N$38
  Top 0.152: MOTOR_POWER_8.5 50.83,41.94 50.83,42.77 52.12,44.07 52.12,45.74 53.34,46.96 MOTOR_8.3
N$39
  Bottom 0.152: MOTOR_POWER_8.6 51.66,44.45 53.03,45.82 53.87,45.82 54.56,46.51 54.56,48.26 53.34,49.48 MOTOR_8.4
N$40
  Top 0.152: PUMP4.5 PUMP4.6
N$41
  Top 0.152: MOTOR_POWER_9.3 33.07,36.83 33.07,37.74 35.51,40.18 35.51,41.86 MOTOR_9.1
N$42
  Top 0.152: MOTOR_POWER_9.4 33.07,39.42 33.07,40.26 34.37,41.55 34.37,43.31 35.51,44.45 MOTOR_9.2
N$43
  Top 0.152: MOTOR_POWER_9.5 33.07,41.94 33.07,42.77 34.37,44.07 34.37,45.82 35.51,46.96 MOTOR_9.3
N$44
  Top 0.152: PUMP5.6 20.34,36.83 20.34,39.34 PUMP5.5
N$45
  Bottom 0.152: MOTOR_POWER_9.6 33.83,44.45 35.2,45.82 36.12,45.82 36.73,46.43 36.73,47.95 35.59,49.1 35.59,49.48 MOTOR_9.4
N$46
  Top 0.152: MOTOR_POWER_10.3 15.24,37.67 17.75,40.18 17.75,41.86 MOTOR_10.1
N$47
  Top 0.152: MOTOR_POWER_10.4 15.24,40.18 16.61,41.55 16.61,43.31 17.75,44.45 MOTOR_10.2
N$48
  Top 0.152: PUMP6.6 2.59,36.83 2.59,39.34 PUMP6.5
N$49
  Top 0.152: MOTOR_POWER_10.5 15.24,42.77 16.61,44.14 16.61,45.82 MOTOR_10.3
N$50
  Bottom 0.152: MOTOR_POWER_10.6 16.08,44.45 17.45,45.82 18.29,45.82 18.97,46.51 18.97,48.34 MOTOR_10.4
N$51
  Top 0.152: MOTOR_POWER_11.3 86.41,63.5 86.41,64.41 88.85,66.85 88.85,68.53 MOTOR_11.1
N$52
  Top 0.152: PUMP7.6 73.69,63.5 73.69,66.02 PUMP7.5
N$53
  Top 0.152: MOTOR_POWER_11.4 86.41,66.09 86.41,66.93 87.71,68.22 87.71,69.98 88.85,71.12 MOTOR_11.2
N$54
  Top 0.152: MOTOR_POWER_11.5 86.41,68.61 86.41,69.44 87.71,70.74 87.71,72.49 88.85,73.64 MOTOR_11.3
N$55
  Bottom 0.152: MOTOR_POWER_11.6 87.17,71.12 88.54,72.49 89.46,72.49 90.07,73.1 90.07,75.01 88.92,76.15 MOTOR_11.4
N$56
  Top 0.152: PUMP8.6 55.93,63.5 55.93,66.02 PUMP8.5
N$57
  Bottom 0.152: MOTOR_POWER_12.3 68.58,64.34 71.09,66.85 71.09,68.53 MOTOR_12.1
N$58
  Bottom 0.152: MOTOR_POWER_12.4 68.58,66.85 69.95,68.22 69.95,69.98 71.09,71.12 MOTOR_12.2
N$59
  Top 0.152: MOTOR_POWER_12.5 68.58,69.44 69.95,70.82 69.95,72.49 MOTOR_12.3
N$60
  Top 0.152: PUMP9.5 PUMP9.6
N$61
  Top 0.152: MOTOR_POWER_12.6 68.58,71.5 67.06,73.03 67.06,76.84 67.97,77.75 69.57,77.75 MOTOR_12.4
N$62
  Top 0.152: MOTOR_13.1 53.34,66.85 50.83,64.34 50.83,63.5 MOTOR_POWER_13.3
N$63
  Top 0.152: MOTOR_13.2 52.12,69.9 52.12,68.22 50.83,66.93 50.83,66.09 MOTOR_POWER_13.4
N$64
  Top 0.152: PUMP10.6 20.34,63.5 20.34,66.02 PUMP10.5
N$65
  Top 0.152: MOTOR_POWER_13.5 50.83,68.61 50.83,69.44 52.12,70.74 52.12,72.42 53.34,73.64 MOTOR_13.3
N$66
  Bottom 0.152: MOTOR_POWER_13.6 51.66,71.12 53.03,72.49 53.87,72.49 54.56,73.18 54.56,74.93 53.34,76.15 MOTOR_13.4
N$67
  Top 0.152: MOTOR_POWER_14.3 33.07,63.5 33.07,64.41 35.51,66.85 35.51,68.53 MOTOR_14.1
N$68
  Top 0.152: MOTOR_POWER_14.4 33.07,66.09 33.07,66.93 34.37,68.22 34.37,69.98 35.51,71.12 MOTOR_14.2
N$69
  Top 0.152: MOTOR_POWER_14.5 33.07,68.61 33.07,69.44 34.37,70.74 34.37,72.49 35.51,73.64 MOTOR_14.3
N$70
  Bottom 0.152: MOTOR_POWER_14.6 33.83,71.12 35.2,72.49 36.12,72.49 36.73,73.1 36.73,75.01 35.59,76.15 MOTOR_14.4
N$71  (via drill 0.35)
  Top 0.152: B1.GND@3 B1.GND@2 | J6.2 MOTOR_POWER_4.1 86.33,8.87 v77.11,8.87 | J5.2 71.09,11.45 68.58,8.94 MOTOR_POWER_3.1 68.58,9.02 57.45,9.02 56.24,10.24 54.48,10.24 53.34,11.38 J4.2 53.34,11.45 | 53.34,11.45 50.83,8.94 MOTOR_POWER_2.1 | B1.GND@0 40.69,5.13 43.13,5.13 B1.GND@1 | J3.2 MOTOR_POWER_1.1 | B1.GND@4 26.44,53.37 27.28,53.37 32.31,58.39 32.99,58.39 MOTOR_POWER_14.1 | MOTOR_POWER_12.1 68.58,58.47 57.53,58.47 56.39,59.61 51.97,59.61 50.83,58.47 MOTOR_POWER_13.1 | v82.53,60.45 84.51,58.47 86.33,58.47 MOTOR_POWER_11.1 | 68.58,31.8 57.61,31.8 56.39,30.58 54.56,30.58 | 54.56,30.58 51.97,30.58 MOTOR_POWER_8.1 50.75,31.72 49.61,30.58 37.57,30.58 36.42,31.72 33.07,31.72 MOTOR_POWER_9.1 32.99,31.8 31.85,32.94 31.85,34.85 32.46,35.46 33.38,35.46 34.21,36.3 34.21,37.21 37.57,40.56 38.48,40.56 39.32,41.4 v39.32,47.88 | 68.58,31.8 72.01,31.8 73.15,32.94 77.19,32.94 78.33,31.8 86.33,31.8 MOTOR_POWER_6.1 | 68.58,31.8 MOTOR_POWER_7.1 | 53.34,11.45 53.34,16.87 54.56,18.09 54.56,30.58
  Bottom 0.152: B1.GND@2 90.14,10.16 88.92,11.38 J6.2 | B1.GND@0 40.62,5.13 40.16,5.13 36.73,8.56 36.73,10.24 35.59,11.38 J3.2 | MOTOR_POWER_2.1 50.75,8.87 46.94,8.87 43.2,5.13 B1.GND@1 | v77.11,8.87 75.36,8.87 74.22,7.72 69.72,7.72 68.58,8.87 MOTOR_POWER_3.1 | MOTOR_POWER_13.1 50.75,58.39 39.78,58.39 38.63,57.25 34.21,57.25 33.07,58.39 MOTOR_POWER_14.1 | v82.53,60.45 74.83,60.45 73.99,59.61 69.72,59.61 68.58,58.47 MOTOR_POWER_12.1 | MOTOR_POWER_5.1 15.24,9.7 9.98,14.96 9.98,27.23 14.48,31.72 15.24,31.72 | 15.24,31.72 18.67,31.72 19.81,30.58 31.85,30.58 MOTOR_POWER_9.1 | 15.24,31.72 MOTOR_POWER_10.1 | v39.32,47.88 39.32,50.01 37.95,51.38 29.18,51.38 27.28,53.29 26.44,53.29 B1.GND@4
N$72
  Top 0.152: B1.A1 53.34,5.13 52.88,5.13 48.84,9.17 48.84,13.36 38.1,24.11 RIGHT_STEP.7
  Bottom 0.152: RIGHT_STEP.7 38.1,24.56 36.88,25.78 36.88,27.08 35.74,28.22 28.8,28.22 24.77,24.18 20.34,24.18 LEFT_STEP.7
N$73
  Bottom 0.152: LEFT_STEP.6 31.32,21.59 32.54,20.37 36.88,20.37 RIGHT_STEP.6 37.72,21.13 39.32,19.53 39.32,18.54 38.63,17.86 37.72,17.86 36.88,17.02 36.88,10.92 37.57,10.24 38.48,10.24 41.83,6.88 41.83,4.75 42.67,3.91 53.87,3.91 55.02,5.05 55.85,5.05 B1.A2
N$74
  Bottom 0.152: 29.95,19 31.39,19 32.54,17.86 36.96,17.86 38.1,19 RIGHT_STEP.5 | 29.95,19 20.34,19 LEFT_STEP.5 | 29.95,19 29.95,10.24 32.46,7.72 34.59,7.72 36.73,5.59 36.73,4.75 37.87,3.61 56.08,3.61 57.53,5.05 58.37,5.05 B1.A3
N$75
  Bottom 0.152: 72.47,22.96 70.79,22.96 69.95,22.12 69.95,21.29 69.04,20.37 64.01,20.37 56.54,27.84 55.32,27.84 54.71,27.23 54.71,26.16 55.85,25.02 55.85,24.18 Z_LEFT.7 | 72.47,22.96 73.61,24.11 Z_RIGHT.7 | 72.47,22.96 72.47,18.54 73.15,17.86 73.99,17.86 84.43,7.42 85.72,7.42 87.55,5.59 87.55,4.75 88.7,3.61 93.95,3.61 97.99,7.65 97.99,12.9 96.55,14.35 96.55,15.19 B1.51
N$76
  Top 0.152: Z_LEFT.6 60.43,21.59 61.42,20.6 62.03,20.6 67.06,25.63 67.06,27.53 68.66,29.13 70.33,29.13 72.47,27 72.47,22.73 73.61,21.59 Z_RIGHT.6 73.69,21.59 79.93,15.34 86.87,15.34 90.53,19 97,19 97.69,18.31 97.69,17.25 97,16.56 96.16,16.56 95.33,15.72 95.33,14.88 94.03,13.59 94.03,12.75 B1.52
N$77
  Top 0.152: Z_RIGHT.5 72.47,17.86 72.47,16.18 69.04,12.75 68.12,12.75 61.87,19 55.93,19 Z_LEFT.5
  Bottom 0.152: B1.53 96.55,12.68 96.55,11.84 97.69,10.69 97.69,7.8 93.8,3.91 90.91,3.91 90.07,4.75 90.07,5.59 87.94,7.72 84.96,7.72 73.69,19 Z_RIGHT.5
N$78  (via drill 0.35)
  Top 0.152: PUMP8.4 55.93,68.53 66.9,68.53 68.05,67.39 72.47,67.39 PUMP7.4 73.61,68.45 75.74,66.32 75.74,65.86 83.74,57.86 84.43,57.86 91.44,50.85 93.95,50.85 B1.22 | v2.29,30.28 1.37,31.19 1.37,40.72 2.52,41.86 PUMP6.4 | PUMP4.4 38.1,42.77 36.73,44.14 36.73,50.09 35.74,51.08 28.8,51.08 20.34,42.62 20.34,41.94 PUMP5.4
  Bottom 0.152: PUMP8.4 54.71,69.75 50.29,69.75 49.23,68.68 38.1,68.68 PUMP9.4 38.1,68.61 36.96,69.75 32.46,69.75 31.32,68.61 20.34,68.61 PUMP10.4 20.27,68.53 20.27,67.69 9.98,57.4 9.98,43.08 | PUMP4.4 38.1,41.94 49.15,41.94 50.29,43.08 54.71,43.08 PUMP3.4 55.93,41.94 57.07,43.08 71.63,43.08 72.77,41.94 73.61,41.94 PUMP2.4 | v2.29,30.28 3.73,28.83 3.73,21.06 2.59,19.91 2.59,19.07 PUMP1.4 | 9.98,43.08 3.73,43.08 2.59,41.94 PUMP6.4 | 9.98,43.08 18.29,43.08 19.43,41.94 20.27,41.94 PUMP5.4
N$79  (via drill 0.35)
  Top 0.152: PUMP9.3 v41.38,67.84 41.3,67.84 41.3,55.12 v40.39,54.2 | B1.23 96.47,50.85 95.63,50.85 94.34,52.15 90.6,52.15 84.58,58.17 83.9,58.17 76.05,66.02 76.05,68.76 73.69,71.12 PUMP7.3 | v54.56,41.02 54.56,42.32 55.85,43.61 55.85,44.45 PUMP3.3
  Bottom 0.152: v41.38,67.84 49.84,67.84 50.29,67.39 56.39,67.39 57.07,68.07 57.07,69.9 | 57.07,69.9 57.07,69.98 55.93,71.12 PUMP8.3 | PUMP7.3 72.85,71.12 71.63,72.34 70.64,72.34 69.8,71.5 69.8,70.66 69.04,69.9 57.07,69.9 | 21.49,44.45 28.8,44.45 30.1,43.16 36.8,43.16 36.84,43.19 | 21.49,44.45 PUMP5.3 | 36.84,43.19 PUMP4.3 40.39,46.74 v40.39,54.2 | 36.84,43.19 36.88,43.16 36.88,41.4 37.57,40.72 53.87,40.72 54.18,41.02 v54.56,41.02 54.86,40.72 74.14,40.72 74.83,41.4 74.83,42.47 73.69,43.61 73.69,44.45 PUMP2.3 | 1.37,40.72 1.37,43.31 2.52,44.45 PUMP6.3 2.44,44.45 1.37,45.52 1.37,69.29 3.2,71.12 PUMP10.3 | 1.37,40.72 1.37,23.57 2.52,22.43 2.52,21.59 PUMP1.3 | 21.49,44.45 21.49,41.4 20.8,40.72 1.37,40.72
N$80  (via drill 0.35)
  Top 0.152: PUMP1.2 2.52,24.18 2.52,25.02 1.37,26.16 1.37,28.45 3.73,30.81 3.73,45.82 2.59,46.96 PUMP6.2 | 21.49,51.08 21.49,55.57 19.13,57.94 19.13,72.49 20.27,73.64 PUMP10.2 | 21.49,51.08 21.49,49.02 20.34,47.88 20.34,47.04 PUMP5.2 | PUMP4.2 38.1,47.73 41.45,51.08 53.49,51.08 54.71,49.86 54.71,48.18 55.85,47.04 PUMP3.2 | v45.19,76.38 46.56,77.75 53.49,77.75 54.71,76.53 54.71,74.85 55.85,73.71 PUMP8.2 55.93,73.71 60.27,73.71 64.62,78.05 70.94,78.05 72.47,76.53 72.47,74.85 PUMP7.2 | B1.24 93.57,48.26 84.28,57.56 83.59,57.56 77.76,63.39 | v75.13,66.02 77.76,63.39 | v69.88,52.45 69.88,56.34 73.3,59.77 74.14,59.77 77.76,63.39 | v27.89,51.08 21.49,51.08
  Bottom 0.152: PUMP10.2 21.49,72.49 21.49,70.59 20.8,69.9 19.96,69.9 9.68,59.61 9.68,54.97 2.59,47.88 2.59,47.04 PUMP6.2 | 69.88,51.08 59.28,51.08 55.93,47.73 55.93,47.04 PUMP3.2 | 69.88,51.08 71.25,51.08 72.31,50.01 72.31,49.17 73.61,47.88 73.61,47.04 PUMP2.2 | v45.19,76.38 42.52,73.71 38.1,73.71 PUMP9.2 | v75.13,66.02 75.13,72.19 PUMP7.2 | v69.88,52.45 69.88,51.08 | v27.89,51.08 35.74,51.08 36.88,49.94 36.88,48.26 38.1,47.04 PUMP4.2
N$81
  Bottom 0.152: Z_RIGHT.8 73.69,26.62 73.69,25.78 85.19,14.27 85.19,10.92 86.03,10.08 86.87,10.08 87.71,9.25 87.71,8.41 90.98,5.13 91.44,5.13 B1.A15
N$82  (via drill 0.35)
  Top 0.152: v30.56,12.6 19.81,12.6 18.67,11.45 15.24,11.45 MOTOR_POWER_5.2 | MOTOR_POWER_9.2 34.21,33.1 41.91,33.1 43.05,34.24 50.75,34.24 MOTOR_POWER_8.2 51.97,35.46 56.39,35.46 57.53,34.31 v62.64,34.31 | v46.79,12.6 35.05,12.6 33.91,11.45 33.07,11.45 MOTOR_POWER_1.2 | MOTOR_POWER_13.2 51.97,62.13 56.39,62.13 57.53,60.98 68.58,60.98 MOTOR_POWER_12.2 | B1.5V@2 96.47,53.37 94.03,53.37 B1.5V@1 MOTOR_POWER_11.2 85.19,62.13 v82.53,62.13 | v76.96,11.45 86.33,11.45 MOTOR_POWER_4.2
  Bottom 0.152: v30.56,12.6 31.85,12.6 MOTOR_POWER_1.2 34.21,10.24 34.21,8.56 37.64,5.13 38.1,5.13 B1.5V@0 | MOTOR_POWER_10.2 15.24,34.24 18.67,34.24 19.81,33.1 31.85,33.1 32.99,34.24 MOTOR_POWER_9.2 | v62.64,34.31 68.58,34.31 MOTOR_POWER_7.2 | 47.32,12.6 47.32,25.02 49.23,26.92 49.23,32.72 MOTOR_POWER_8.2 | 47.32,12.6 47.32,12.52 48.39,11.45 50.75,11.45 MOTOR_POWER_2.2 50.83,11.45 51.66,11.45 52.81,12.6 67.44,12.6 68.58,11.45 MOTOR_POWER_3.2 68.58,11.53 69.49,11.53 70.56,12.6 75.82,12.6 v76.96,11.45 | 47.32,12.6 v46.79,12.6 | MOTOR_POWER_13.2 49.61,59.77 37.57,59.77 36.42,60.91 33.07,60.91 MOTOR_POWER_14.2 | 95.17,26.77 95.17,28.45 94.34,29.29 91.36,29.29 MOTOR_POWER_6.2 | 95.17,26.77 95.17,24.87 94.49,24.18 93.57,24.18 92.51,23.11 92.51,18.39 86.41,12.29 86.41,11.45 MOTOR_POWER_4.2 | 95.17,26.77 97.08,26.77 97.69,27.38 97.69,33.55 97,34.24 96.16,34.24 95.33,35.08 95.33,43.69 96.01,44.37 96.85,44.37 97.99,45.52 97.99,51 96.55,52.45 96.55,53.29 B1.5V@2 | v82.53,62.13 73.15,62.13 72.01,60.98 68.58,60.98 MOTOR_POWER_12.2
N$83  (via drill 0.35)
  Top 0.5: C5.2 77.5,26.62 80.39,26.62 82.83,24.18 86.33,24.18 MOTOR_POWER_4.7 | v82.98,37.59 82.98,43.61 MOTOR_POWER_6.7 | v57.53,51.23 57.99,51.23 C7.2 | v63.4,36.75 63.4,41.78 68.58,46.96 MOTOR_POWER_7.7 | v75.21,30.66 74.98,30.66 74.37,30.05 72.92,30.05 72.54,30.43 v69.88,30.43 | MOTOR_POWER_11.7 86.33,73.71 82.83,73.71 80.39,76.15 77.5,76.15 C11.2 77.27,76.38 74.75,78.89 64.24,78.89 61.57,76.23 59.74,76.23 C12.2 59.44,76.23 v56.62,79.05 | C14.2 24.16,76.15 27.05,76.15 29.49,73.71 32.99,73.71 MOTOR_POWER_14.7 | C13.2 41.91,76.15 43.81,76.15 46.25,73.71 50.75,73.71 MOTOR_POWER_13.7 | J2.1 3.81,57.86 6.33,55.35 6.33,49.55 C10.2 6.55,49.4 8.91,47.04 12.12,47.04 | 12.12,47.04 15.24,47.04 MOTOR_POWER_10.7 | C3.2 41.91,26.62 43.97,26.62 46.41,24.18 50.75,24.18 MOTOR_POWER_2.7 | 9.22,26.62 6.4,26.62 C1.2 | 9.22,26.62 11.66,24.18 15.24,24.18 MOTOR_POWER_5.7 | C2.2 24.16,26.62 27.05,26.62 29.49,24.18 32.99,24.18 MOTOR_POWER_1.7 | 12.12,29.44 11.89,29.44 9.3,26.85 9.22,26.62 | 12.12,29.44 20.42,29.44 22.02,31.04 22.02,37.29 31.7,46.96 32.99,46.96 MOTOR_POWER_9.7 | 12.12,29.44 12.12,47.04 | v12.34,77.9 3.81,69.37 J1.1 | v41.91,34.92 C8.2
  Bottom 0.5: C6.2 77.5,49.48 80.39,49.48 82.83,47.04 86.33,47.04 MOTOR_POWER_6.7 | v82.98,37.59 82.98,30.66 | 82.98,30.66 82.98,30.5 84.12,29.36 84.12,26.39 86.33,24.18 MOTOR_POWER_4.7 | 61.49,26.62 62.56,26.62 65,24.18 68.58,24.18 MOTOR_POWER_3.7 | 61.49,26.62 59.74,26.62 C4.2 | 49.07,47.04 50.75,47.04 MOTOR_POWER_8.7 | 49.07,47.04 47.24,47.04 44.81,49.48 41.91,49.48 C8.2 | C7.2 59.74,49.48 62.56,49.48 65,47.04 68.58,47.04 MOTOR_POWER_7.7 | 49.07,47.04 49.07,50.24 50.06,51.23 v57.53,51.23 | 61.49,30.05 61.49,34.85 v63.4,36.75 | 61.49,30.05 61.49,26.62 | v75.21,30.66 82.98,30.66 | v69.88,30.43 69.72,30.43 69.34,30.05 61.49,30.05 | C12.2 59.74,76.15 62.56,76.15 65,73.71 68.58,73.71 MOTOR_POWER_12.7 | 48.77,76.68 49.07,76.38 49.07,75.39 MOTOR_POWER_13.7 | 48.77,76.68 46.48,78.97 33.38,78.97 31.32,76.91 31.32,75.39 32.99,73.71 MOTOR_POWER_14.7 | v56.62,79.05 51.13,79.05 48.77,76.68 | J1.1 3.81,64.03 5.71,62.13 5.71,59.84 3.81,57.94 J2.1 | C9.2 24.16,49.48 24.99,49.48 27.43,47.04 32.99,47.04 MOTOR_POWER_9.7 | MOTOR_POWER_5.7 15.24,24.18 13.49,25.93 13.49,27.38 14.48,28.37 22.4,28.37 24.08,26.7 C2.2 26.52,29.06 38.18,29.06 | 38.18,29.06 40.54,26.7 41.91,26.7 C3.2 | v12.34,77.9 21.03,77.9 22.71,76.23 24.08,76.23 C14.2 | v41.91,34.92 41.91,32.94 38.25,29.29 38.18,29.06
N$84  (via drill 0.35)
  Top 0.5: MOTOR_POWER_6.8 86.33,49.55 82.6,49.55 C6.1 82.37,49.33 82.37,44.45 81.84,43.92 81.84,37.13 82.53,36.45 84.05,36.45 v84.12,36.52 | C5.1 82.6,26.7 86.33,26.7 MOTOR_POWER_4.8 | MOTOR_POWER_7.8 68.58,49.55 64.77,49.55 C7.1 64.69,49.33 64.69,44.53 60.43,40.26 v60.43,35.31 | MOTOR_POWER_8.8 50.75,49.55 47.02,49.55 C8.1 47.02,49.33 v47.02,36.45 | MOTOR_POWER_2.8 50.75,26.7 47.02,26.7 C3.1 46.79,26.77 45.26,26.77 43.66,28.37 34.82,28.37 33.22,26.77 MOTOR_POWER_1.8 32.99,26.7 29.26,26.7 C2.1 27.51,28.37 | C1.1 11.43,26.7 15.24,26.7 MOTOR_POWER_5.8 15.47,26.77 17.07,28.37 27.51,28.37 | v60.27,30.81 64.39,26.7 64.77,26.7 C4.1 | C9.1 29.26,49.55 32.99,49.55 MOTOR_POWER_9.8 | MOTOR_POWER_10.8 15.24,49.55 11.43,49.55 C10.1 11.35,49.78 11.35,53.82 3.96,61.21 J2.2 3.81,66.7 1.91,68.61 1.91,70.89 3.81,72.8 J1.2 | C14.1 29.26,76.23 32.99,76.23 MOTOR_POWER_14.8 | C13.1 47.02,76.23 50.75,76.23 MOTOR_POWER_13.8 | C11.1 82.6,76.23 86.33,76.23 MOTOR_POWER_11.8 | v30.48,44.14 27.58,41.25 27.58,28.6 27.51,28.37
  Bottom 0.5: C4.1 64.77,26.7 68.58,26.7 MOTOR_POWER_3.8 68.81,26.77 70.41,28.37 80.85,28.37 C5.1 | v84.12,36.52 84.12,30.81 86.33,28.6 86.33,26.7 MOTOR_POWER_4.8 | v47.02,36.45 47.02,26.7 C3.1 | v60.43,35.31 60.43,33.86 58.83,32.26 | 58.83,32.26 55.24,28.68 52.81,28.68 MOTOR_POWER_2.8 | 58.83,32.26 v60.27,30.81 | 22.55,51.23 16.92,51.23 15.24,49.55 MOTOR_POWER_10.8 | 22.55,51.23 24.69,51.23 26.36,49.55 29.18,49.55 C9.1 | MOTOR_POWER_14.8 33.07,76.23 34.75,77.9 45.26,77.9 46.94,76.23 C13.1 | C11.1 80.85,77.9 70.41,77.9 68.81,76.3 MOTOR_POWER_12.8 68.58,76.23 64.77,76.23 C12.1 64.54,76.3 62.94,77.9 52.5,77.9 MOTOR_POWER_13.8 | C14.1 26.36,79.05 11.89,79.05 5.71,72.87 3.81,72.87 J1.2 | v30.48,44.14 30.33,44.14 28.5,45.97 25.45,45.97 22.55,48.87 22.55,51.23
N$85
  Top 0.152: B1.A14 88.85,5.13 88.01,5.13 84.89,8.25 76.81,8.25 73.69,11.38 Z_RIGHT.2
N$86
  Top 0.152: Z_RIGHT.1 74.6,7.95 82.68,7.95 85.5,5.13 86.33,5.13 B1.A13
N$87
  Top 0.152: B1.A12 83.82,5.13 82.91,5.13 80.39,7.65 57.15,7.65 55.93,8.87 Z_LEFT.1
N$88
  Bottom 0.152: Z_LEFT.2 57.07,10.24 76.66,10.24 81.23,5.66 81.23,5.13 B1.A11
N$89
  Bottom 0.152: B1.A10 78.79,5.05 79.63,5.05 80.77,3.91 81.84,3.91 82.45,4.52 82.45,6.88 73.99,15.34 71.48,15.34 68.96,17.86 65.99,17.86 57.23,26.62 55.93,26.62 Z_LEFT.8
N$90
  Top 0.152: B1.A9 76.2,5.05 75.36,5.05 72.39,2.08 46.48,2.08 44.35,4.22 44.35,5.59 41.07,8.87 38.1,8.87 RIGHT_STEP.1
N$91
  Bottom 0.152: B1.A8 73.61,5.13 72.39,5.13 70.1,7.42 59.05,7.42 56.24,10.24 39.24,10.24 38.1,11.38 RIGHT_STEP.2
N$92
  Top 0.152: B1.A7 68.58,5.13 67.67,5.13 66.52,6.27 55.4,6.27 54.56,5.44 54.56,4.6 53.87,3.91 52.81,3.91 51.97,4.75 51.97,5.59 48.54,9.02 48.54,13.13 38.71,22.96 37.57,22.96 36.88,23.65 36.88,25.4 38.1,26.62 RIGHT_STEP.8
N$93
  Bottom 0.152: LEFT_STEP.1 27.74,1.47 61.57,1.47 65.15,5.05 65.99,5.05 B1.A6
N$94  (via drill 0.35)
  Top 0.152: v46.79,2.69 60.27,2.69 62.64,5.05 63.48,5.05 B1.A5
  Bottom 0.152: v46.79,2.69 29.03,2.69 20.34,11.38 LEFT_STEP.2
N$95  (via drill 0.35)
  Top 0.152: v39.4,2.08 36.73,4.75 36.73,5.59 34.59,7.72 32.46,7.72 31.17,9.02 31.17,15.8 20.34,26.62 LEFT_STEP.8
  Bottom 0.152: v39.4,2.08 57.61,2.08 60.58,5.05 60.96,5.05 B1.A4
N$96
  Top 0.152: J6.1 88.92,8.94 88.92,9.78 93.95,14.81 93.95,15.19 B1.50
N$97
  Top 0.152: J5.1 71.17,8.94 71.17,9.78 72.47,11.07 72.47,11.91 73.3,12.75 89.76,12.75 93.57,16.56 95.25,16.56 96.47,17.78 B1.49
N$98
  Bottom 0.152: J4.1 53.34,8.87 54.18,8.87 56.46,6.58 70.48,6.58 73.76,3.3 94.11,3.3 98.3,7.49 98.3,15.19 96.93,16.56 95.25,16.56 94.03,17.78 B1.48
N$99  (via drill 0.35)
  Top 0.152: v47.93,12.83 45.34,10.24 37.72,10.24 36.42,8.94 35.59,8.94 J3.1 | v61.72,21.21 62.03,21.21 66.75,25.93 66.75,27.69 68.5,29.44 72.31,29.44 73.53,28.22 89.46,28.22 93.65,24.03 94.49,24.03 95.33,23.19 95.33,21.51 B1.47
  Bottom 0.152: v47.93,12.83 50.44,15.34 53.03,15.34 55.55,17.86 58.37,17.86 v61.72,21.21
N$100  (via drill 0.35)
  Top 0.152: v95.17,6.2 90.14,1.17 20.8,1.17 13.11,8.87 2.59,8.87 PUMP1.8
  Bottom 0.152: v95.17,6.2 95.17,15.72 94.34,16.56 93.5,16.56 92.81,17.25 92.81,19.15 B1.46
N$101
  Top 0.152: PUMP1.7 2.59,11.38 11.05,11.38 20.95,1.47 89.53,1.47 97.99,9.93 97.99,21.36 96.55,22.81 B1.45
N$102  (via drill 0.35)
  Top 0.152: v18.14,12.75 15.54,15.34 13.87,15.34 PUMP1.1
  Bottom 0.152: v18.14,12.75 20.73,12.75 30.18,3.3 58.37,3.3 59.59,4.52 59.59,5.44 60.43,6.27 69.11,6.27 72.39,3 94.26,3 98.6,7.34 98.6,17.4 97,19 96.16,19 95.33,19.84 95.33,20.68 94.03,21.97 94.03,22.81 B1.44
N$103
  Top 0.152: B1.43 95.71,25.4 94.34,26.77 91.36,26.77 87.86,30.28 76.96,30.28 75.51,31.72 73.69,31.72 PUMP2.8
N$104
  Bottom 0.152: B1.42 93.8,25.4 91.36,27.84 88.32,27.84 85.19,30.96 85.19,36.83 83.44,38.58 82.6,38.58 78.33,34.31 73.69,34.31 PUMP2.7
N$105  (via drill 0.35)
  Top 0.152: v92.05,34.39 88.54,37.9 v88.54,38.96
  Bottom 0.152: v92.05,34.39 94.34,34.39 95.17,33.55 95.17,30.12 96.47,28.83 96.47,27.99 B1.41 | v88.54,38.96 86.79,40.72 82.45,40.72 73.69,49.48 PUMP2.1
N$106  (via drill 0.35)
  Top 0.152: v75.82,29.52 v87.55,29.52
  Bottom 0.152: v87.55,29.52 90.14,29.52 91.67,27.99 93.95,27.99 B1.40 | v75.82,29.52 74.22,29.52 69.8,33.93 69.8,34.77 68.96,35.61 65.91,35.61 63.78,37.74 61.49,37.74 55.93,32.18 55.93,31.8 PUMP3.8
N$107
  Top 0.152: PUMP3.7 56.46,33.71 62.94,33.71 64.69,35.46 75.13,35.46 77.5,33.1 86.72,33.1 88.01,31.8 94.34,31.8 95.63,30.5 96.47,30.5 B1.39
N$108
  Bottom 0.152: B1.38 93.95,30.5 93.95,31.34 90.22,35.08 90.22,38.89 87.55,41.55 87.55,42.39 86.72,43.23 81.76,43.23 72.31,52.68 72.31,53.82 71.63,54.51 66.37,54.51 63.25,51.38 59.05,51.38 57.23,49.55 55.93,49.55 PUMP3.1
N$109  (via drill 0.35)
  Top 0.152: v72.24,32.94 50.29,32.94 49.15,31.8 38.1,31.8 PUMP4.8 | v77.42,31.8 77.88,31.8 79.1,30.58 92.2,30.58 93.5,29.29 97,29.29 97.69,29.97 97.69,31.88 96.55,33.02 B1.37
  Bottom 0.152: v72.24,32.94 76.28,32.94 v77.42,31.8
N$110
  Top 0.152: B1.36 89.31,33.02 86.79,35.53 82.22,35.53 74.83,42.93 74.83,47.5 73.99,48.34 73.15,48.34 72.31,49.17 72.31,50.01 71.25,51.08 64.31,51.08 57.07,43.84 57.07,41.4 56.24,40.56 55.4,40.56 51.97,37.13 51.97,36.3 51.13,35.46 43.81,35.46 42.29,33.93 38.41,33.93 38.1,34.24 PUMP4.7
N$111
  Top 0.152: B1.35 95.33,36.75 95.33,41.02 94.49,41.86 93.57,41.86 91.29,44.14 91.29,49.33 89.08,51.54 64.31,51.54 60.88,48.11 59.13,48.11 55.85,51.38 41.3,51.38 39.47,49.55 38.1,49.55 PUMP4.1
N$112
  Top 0.152: PUMP5.8 20.27,31.8 20.27,32.64 18.97,33.93 18.97,57.63 18.82,57.78 18.82,76.38 22.48,80.04 86.79,80.04 97.99,68.83 97.99,35.31 97.08,34.39 95.17,34.39 94.03,35.53 B1.34
N$113
  Bottom 0.152: PUMP5.7 20.27,34.31 19.05,34.31 17.91,35.46 14.71,35.46 9.68,30.43 9.68,12.75 21.26,1.17 92.89,1.17 98.91,7.19 98.91,35.69 96.55,38.05 B1.33
N$114  (via drill 0.35)
  Top 0.152: v20.88,52.38 20.34,51.84 20.34,49.55 PUMP5.1 | v22.71,52.38 23.16,52.38 23.7,51.84 56.08,51.84 57.23,52.98 57.23,53.82 57.91,54.51 65.68,54.51 68.35,51.84 85.11,51.84 v85.42,52.15 | v88.16,50.93 89.23,50.93 90.07,50.09 90.07,39.57 89,38.51 89,37.9 89.31,37.59 93.5,37.59 93.95,38.05 B1.32
  Bottom 0.152: v22.71,52.38 v20.88,52.38 | v85.42,52.15 86.94,52.15 v88.16,50.93
N$115  (via drill 0.35)
  Top 0.152: v4.5,33.71 4.5,39.8 v10.59,45.9 | v82.53,64.72 83.44,64.72 86.03,62.13 89.46,62.13 97.69,53.9 97.69,41.78 96.55,40.64 B1.31
  Bottom 0.152: v4.5,33.71 PUMP6.8 | v10.59,45.9 10.59,46.74 13.72,49.86 13.72,56.03 19.96,62.28 27.58,62.28 32.54,67.23 47.93,67.23 50.44,64.72 65.68,64.72 68.12,62.28 70.71,62.28 73.15,64.72 v82.53,64.72
N$116  (via drill 0.35)
  Top 0.152: v89.61,38.2 91.52,38.2 93.95,40.64 B1.30
  Bottom 0.152: v89.61,38.2 85.8,38.2 85.11,38.89 82.45,38.89 81.76,38.2 14.94,38.2 11.05,34.31 2.59,34.31 PUMP6.7
N$117  (via drill 0.35)
  Top 0.152: v18.21,69.9 18.21,76.68 v21.72,80.19
  Bottom 0.152: v18.21,69.9 2.59,54.28 2.59,49.55 PUMP6.1 | v21.72,80.19 80.54,80.19 84.81,75.92 84.81,65.86 85.95,64.72 86.87,64.72 98.3,53.29 98.3,44.98 96.55,43.23 B1.29
N$118
  Top 0.152: PUMP7.8 74.83,57.25 84.12,57.25 91.59,49.78 91.59,46.43 93.95,44.07 93.95,43.23 B1.28
N$119  (via drill 0.35)
  Top 0.152: v83.74,60.15 82.75,61.14 v81.84,61.14
  Bottom 0.152: v83.74,60.15 83.74,59.31 93.42,49.63 96.85,49.63 97.69,48.79 97.69,47.73 96.55,46.58 96.55,45.74 B1.27 | v81.84,61.14 73.84,61.14 PUMP7.7
N$120
  Bottom 0.152: B1.26 92.81,46.89 92.81,49.02 83.13,58.7 83.13,65.86 73.69,75.31 73.69,76.15 PUMP7.1
N$121
  Bottom 0.152: B1.25 96.47,48.26 96.47,47.35 95.17,46.05 95.17,45.21 94.49,44.53 93.5,44.53 90.37,47.65 90.37,51 84.12,57.25 57.07,57.25 55.93,58.39 PUMP8.8
N$122
  Bottom 0.152: B1.12 31.55,53.37 31.93,53.37 35.51,56.95 51.89,56.95 55.85,60.91 PUMP8.7
N$123
  Top 0.152: PUMP8.1 54.03,78.05 38.25,78.05 36.88,76.68 36.88,60.6 34.06,57.78 34.06,53.37 B1.11
N$124
  Top 0.152: B1.10 36.58,56.87 38.1,58.39 PUMP9.8
N$125
  Top 0.152: PUMP9.7 38.1,60.15 39.32,58.93 39.32,53.52 39.17,53.37 B1.9
N$126
  Top 0.152: PUMP9.1 38.1,75.39 41.99,71.5 41.99,53.67 B1.8
N$127
  Top 0.152: B1.7 45.72,53.29 43.28,53.29 42.14,52.15 25.91,52.15 25.07,52.98 25.07,53.82 20.5,58.39 20.34,58.39 PUMP10.8
N$128
  Bottom 0.152: B1.6 48.23,53.37 47.4,53.37 45.95,54.81 33.83,54.81 32.69,53.67 32.69,52.83 32,52.15 31.01,52.15 30.18,52.98 30.18,53.82 23.09,60.91 20.34,60.91 PUMP10.7
N$129  (via drill 0.35)
  Top 0.152: v31.62,64.87 20.34,76.15 PUMP10.1
  Bottom 0.152: v31.62,64.87 33.38,64.87 35.97,62.28 56.24,62.28 57.07,61.44 57.07,60.45 56.39,59.77 55.55,59.77 50.83,55.04 50.83,53.37 B1.5

### Text on the board
tNames: Arduino Mega 2560 Shield / 10 Stepper Drivers | Designed by Philip Dettinger / Cell Systems Dynamics Group - ETHZurich | + | - | + | - | + | - | + | - | + | FAN | - | + | P10 | P9 | P8 | P7 | POWER | - | - | + | - | + | - | + | - | + | - | + | P6 | P5 | P4 | P3 | P2 | - | + | - | + | - | + | - | + | - | + | P1 | L | R | Z1 | Z2
bNames: ENA | MV+ | M1 | MGND | M2 | M3 | RST | SLP | STP | LV+ | DIR | LGND